# EAGLE design Grove - Gesture v1.0 (EAGLE 7.1.0)

## Sheet 1 of 2
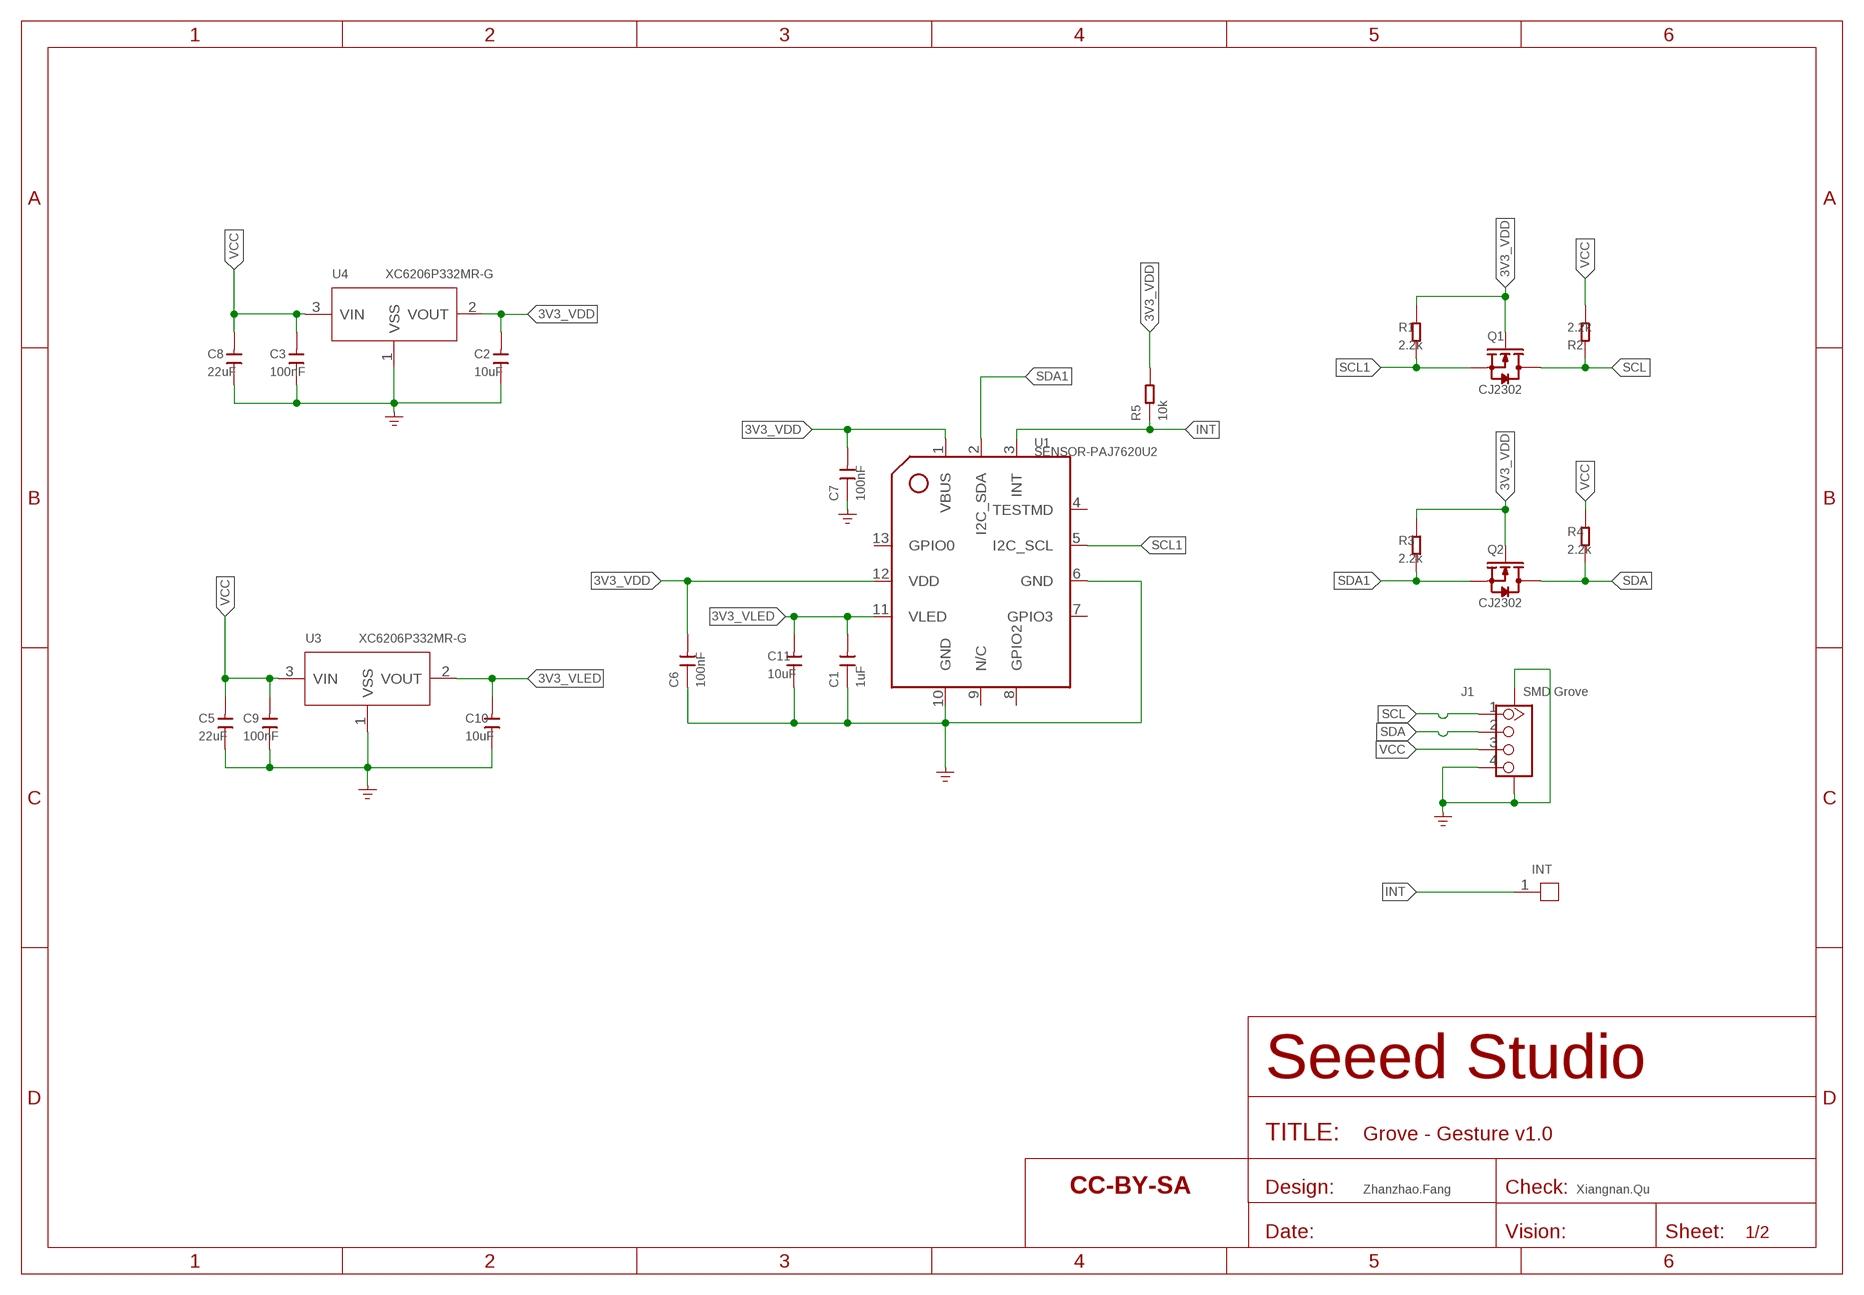
[diagram p0: schematic, sheet 1]

### Parts
C1  1uF  CAP-0603  [C0603]
C2  10uF  CAP-0603  [C0603]
C3  100nF  CAP-0603  [C0603]
C5  22uF  CAP-0805  [C0805]
C6  100nF  CAP-0603  [C0603]
C7  100nF  CAP-0603  [C0603]
C8  22uF  CAP-0805  [C0805]
C9  100nF  CAP-0603  [C0603]
C10  10uF  CAP-0603  [C0603]
C11  10uF  CAP-0603  [C0603]
INT  DNP  HEADER-1P-40  [1P-80/40MIL]
J1  SMD Grove  GROVE-CONNECTOR-SMD'90D'  [HW4-SMD-2.0-90D]
Q1  CJ2302  MOSFET-N'SOT23'  [SOT-23]
Q2  CJ2302  MOSFET-N'SOT23'  [SOT-23]
R1  2.2k  RES-0603  [R0603]
R2  2.2k  RES-0603  [R0603]
R3  2.2k  RES-0603  [R0603]
R4  2.2k  RES-0603  [R0603]
R5  10k  RES-0603  [R0603]
U1  SENSOR-PAJ7620U2  [LGA13-SMD-L5.2*W3*H2MM]
U3  XC6206P332MR-G  PMIC-XC6206PMR  [SOT-23]
U4  XC6206P332MR-G  PMIC-XC6206PMR  [SOT-23]
U$4  SEEEDSTUDIO-OPEN-SCH-FRAME  [SEEEDSTUDIO-PCB-FRAME]

### Nets
3V3_VDD: C2.2 C6.2 C7.2 Q1.1(G) Q2.1(G) R1.2 R3.2 R5.2 U1.1(VBUS) U1.12(VDD) U4.2(VOUT)
3V3_VLED: C1.2 C10.2 C11.2 U1.11(VLED) U3.2(VOUT)
GND: C1.1 C2.1 C3.1 C5.1 C6.1 C7.1 C8.1 C9.1 C10.1 C11.1 J1.4 J1.SS1 J1.SS2 U1.6(GND) U1.10(GND) U3.1(VSS) U4.1(VSS) ; supply symbol labelled GND_POWER
INT: INT.1 R5.1 U1.3(INT)
SCL: J1.1 Q1.3(D) R2.1
SCL1: Q1.2(S) R1.1 U1.5(I2C_SCL)
SDA: J1.2 Q2.3(D) R4.1
SDA1: Q2.2(S) R3.1 U1.2(I2C_SDA)
VCC: C3.2 C5.2 C8.2 C9.2 J1.3 R2.2 R4.2 U3.3(VIN) U4.3(VIN)
Unconnected: U1.4(TESTMD) U1.7(GPIO3) U1.8(GPIO2) U1.9(N/C) U1.13(GPIO0)

### Notes on the sheet
- Zhanzhao.Fang | Xiangnan.Qu

## Sheet 2 of 2
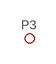
[diagram p1: schematic, sheet 2]

### Parts
P3  PAD-MARK'ANNULAR'  [ROUND-MARK-1.0]

## Library data of the parts
C1-C3 C5-C11 = Discrete-new:CAP: Ceramic Capacitors
INT = Connector-new:HEADER-1P
J1 = Connector-new:GROVE-CONNECTOR-SMD: 4P-SMD-2.0:320110030;4P-SMD-2.0-90D:320110032
P3 = Discrete-new:PAD-MARK; PARTNO: DNP
Q1 Q2 = Discrete-new:MOSFET-N: IRLL014: http://www.vishay.com/docs/91319/sihll014.pdf
R1-R5 = Discrete-new:RES
U1 = template:SENSOR-PAJ7620U2
U3 U4 = IC-new:PMIC-XC6206P: LOW ESR Cap.Compatible Positive Voltage Regulators
U$4 = moudle-new:SEEEDSTUDIO-OPEN-SCH-FRAME

## Net classes
0 default: width 0.102 mm, drill 0.203 mm, clearance 0.102 mm
3 usbvcc: width 0.203 mm, drill 0.305 mm, clearance 0.203 mm

## Board
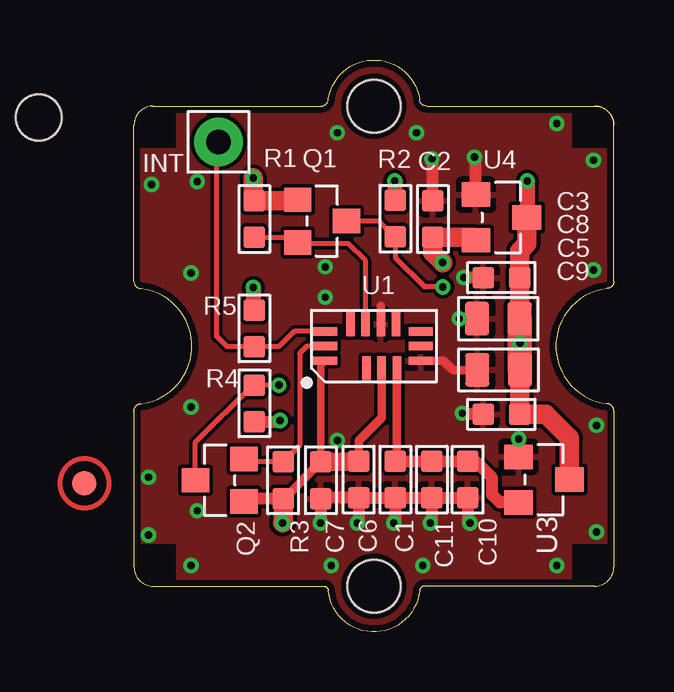
[diagram p2: board, top side]
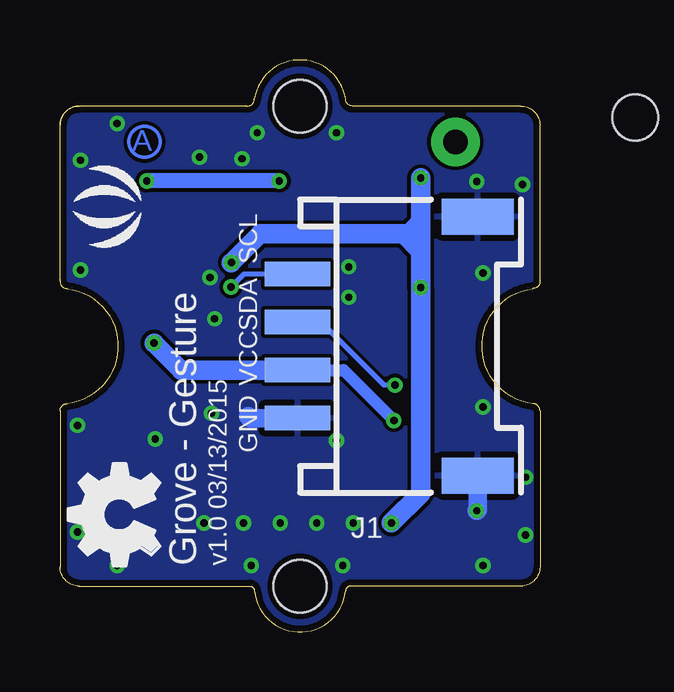
[diagram p3: board, bottom side, seen from below]

Size 20 x 23.83 mm. Coordinates in mm from the lower left corner, seen from the top.
Copper layers (1*16): Top 0.035mm / dielectric 1.5mm / Bottom 0.035mm
Design rules "SeeedStudio_2layer_DRU_no_angle_20140221 *": minimum track width 6mil, minimum drill 12mil, track to track 6mil, track to pad 6mil, pad to pad 6mil, via to via 6mil, smd to smd 0mil, copper to edge 10mil, drill to drill 10mil, minimum pad ring 10mil, minimum via ring 6mil, stop-mask expansion 2mil, vias tented up to drill 25mil, thermal gap 10mil
Holes 1.91 mm at -3.97,21.43

### Footprints (pad centres in the part's own frame; a part is rotated, then mirrored left to right if it is on the bottom)
C0603 = smd 0.889 x 0.889: 1 0,0.762; 2 0,-0.762
C0805 = smd 1.397 x 1.016: 1 0,0.889; 2 0,-0.889
1P-80/40MIL = drill 1.016 pad 2.032: 1 0,0
HW4-SMD-2.0-90D = smd 1.01 x 2.74: 1 -3,-0.1; 2 -1,-0.1; 3 1,-0.1; 4 3,-0.1 | smd 1.5 x 3: SS1 -5.4,7.4; SS2 5.4,7.4
ROUND-MARK-1.0 = smd 1.016 x 1.016: P$1 0,0
SOT-23 = smd 1.016 x 1.143: 1 -0.889,-1.016; 2 0.889,-1.016; 3 0,1.016
R0603 = smd 0.889 x 0.889: 1 0,0.762; 2 0,-0.762
LGA13-SMD-L5.2*W3*H2MM = smd 1 x 0.35: 1 2.02,0.61; 2 2.02,0; 3 2.02,-0.61; 8 -1.96,-0.61; 9 -1.96,0; 10 -1.96,0.61 | smd 0.35 x 1: 4 0.983,-0.92; 5 0.348,-0.92; 6 -0.287,-0.92; 7 -0.922,-0.92; 11 -0.953,0.92; 12 -0.318,0.92; 13 0.318,0.92
SOT-23' = smd 1.016 x 1.2: 1 -0.95,-1.06; 2 0.95,-1.06; 3 0,1.06
GROVE-1*1-TEST-PLATFORM = hole 2.2: 0,-10; 0,10

### Placement (x,y rotation side)
C1  10.89,6.35 180 top
C2  12.45,17.2 0 top
C3  15.31,14.77 90 top
C5  15.19,10.92 90 top
C6  9.37,6.35 180 top
C7  7.79,6.32 180 top
C8  15.18,13.05 90 top
C9  15.31,9.06 90 top
C10  13.9,6.35 180 top
C11  12.41,6.35 180 top
INT  3.52,20.42 0 top
J1  10,11.91 270 bottom
P3  -2.06,6.19 0 top
Q1  7.84,17.12 270 top
Q2  3.57,6.32 90 top
R1  5.02,17.2 180 top
R2  10.89,17.22 180 top
R3  6.22,6.32 0 top
R4  5.02,9.52 0 top
R5  5.02,12.64 180 top
U1  10,11.91 180 top
U3  XC6206P332MR-G  [SOT-23']  17.09,6.35 270 top
U4  XC6206P332MR-G  [SOT-23']  15.31,17.27 270 top
U$1  [OSHW_FILLX150_NOTEXT]  15.84,2.76 90 bottom
U$4  -10.32,-8.79 0 top  (outside the outline)
U$5  [GROVE-1*1-TEST-PLATFORM]  10,11.91 0 top
U$6  [GROVE-1*1-TEST-PLATFORM]  10,11.91 0 top
U$15  [SEEED-SILK-160*153MIL]  18.13,17.75 90 bottom

### Tracks (layer width: path | path; a pad name or v marks a point on that pad's centre or on a via)
3V3_VDD  (via drill 0.3 pad 0.64)
  Top 0.203: 6.9,17.78 6.9,17.93 Q1.1
  Top 0.305: C7.2 7.79,11.11 U1.1
  Top 0.356: 9.24,7.23 C6.2 9.37,7.97 10.32,8.92 U1.12 | R3.2 6.27,5.56 C7.2
  Top 0.508: R3.2 4.72,5.56 Q2.1
  Top 0.635: v4.97,14.35 4.97,13.46 R5.2
  Top 0.762: C7.2 9.34,7.08 C6.2
  Top 0.813: U4.2 14.12,16.44 C2.2 12.45,15.79 v12.86,15.39 | R3.2 6.21,4.57 v6.19,4.54 | v4.97,18.92 4.97,18.02 R1.2 6.79,17.97 Q1.1
  Bottom 0.508: v12.86,15.39 12.77,15.39
  Bottom 0.813: 5.68,16.58 11.66,16.58 v12.86,15.39 | 5.48,16.58 4.97,16.58 | 4.97,15.87 v4.97,14.35 4.97,5.76 v6.19,4.54 | 4.97,15.87 4.97,16.58 | 4.97,16.58 v4.97,18.92 | 5.68,16.58 5.48,16.58 | 5.48,16.58 5.07,16.99 | 5.68,16.58 4.97,15.87
3V3_VLED
  Top 0.203: 10.89,7.08 11.02,7.08 10.89,7.21 11.14,7.21 11.04,7.11 C1.2 10.95,7.17 10.95,7.15 10.89,7.08 | 10.89,7.08 10.76,7.21
  Top 0.356: U1.11 10.95,7.17
  Top 0.508: C1.2 C11.2 C10.2 14.24,7.11 14.93,6.42 14.93,5.71 15.24,5.4 U3.2
GND  (via drill 0.3 pad 0.64)
  Top 0.356: U1.6 10.29,13.59 | U1.10 12.9,11.3 13.3,10.89 14.28,10.89 C5.1
  Top 0.508: C6.1 C1.1 | C1.1 C11.1 | C2.1 12.45,19.68 v12.41,19.72 | U4.1 14.25,19.72 v14.19,19.78 | C8.1 v13.56,13.05 | C3.1 v13.75,14.77 | C9.1 13.73,9.06 v13.68,9.11 | U3.1 v16.03,8.03 v16.03,8.04 | C6.1 7.82,5.58 C7.1 7.79,4.56 v7.78,4.54 | C11.1 C10.1 13.9,4.64 v14,4.54 | C11.1 12.41,4.61 v12.35,4.54 | C1.1 10.89,4.61 v10.83,4.54 | C6.1 9.37,4.61 v9.3,4.54
  Bottom 0.762: J1.4 12.08,8.91 12.16,8.99 | J1.SS2 2.6,5.08 v2.63,5.05
  other vias: 2.63,18.77 19.14,19.66 11.78,20.8 8.48,20.8 19.14,15.08 19.27,8.61 19.27,4.16 0.6,4.03 8.22,2.76 12.03,2.76 2.38,9.37 2.38,14.96 7.97,15.21 7.97,13.94 8.48,7.97 0.6,6.45 2.38,2.76 17.62,2.76 17.62,21.18 0.73,18.64
  pour Top (rank 6): -3.34,24.61 21.3,24.61 21.3,-1.55 -3.34,-1.55
  pour Bottom (rank 6): -3.34,25.12 21.3,25.12 21.3,-1.05 -3.34,-1.05
INT
  Top 0.203: INT.1 3.45,20.34 3.45,12.31 3.88,11.88 R5.1 5.05,11.91 | 4.97,11.91 5.05,11.91 | 5.05,11.91 6.06,11.91 6.67,12.52 U1.3
SCL  (via drill 0.3 pad 0.64)
  Top 0.203: Q1.3 10.23,17.12 R2.1 10.89,15.59 12.11,14.37 v12.87,14.37
  Bottom 0.203: 10.15,14.85 J1.1 12.33,14.91 v12.87,14.37
SCL1
  Top 0.203: R1.1 6.61,16.44 Q1.2 | U1.5 9.65,15.46 8.93,16.18 6.88,16.18 Q1.2 | 7.1,16.25 6.85,16.25 Q1.2
SDA  (via drill 0.3 pad 0.64)
  Top 0.203: v6.04,10.28 R4.1 4.95,10.28 2.56,7.9 Q2.3
  Bottom 0.203: J1.2 9.12,12.91 6.5,10.28 v6.04,10.28
SDA1
  Top 0.203: U1.2 7.21,11.91 6.9,11.6 6.9,7.77 R3.1 4.72,7.08 Q2.2
VCC  (via drill 0.3 pad 0.64)
  Top 0.508: R4.2 6.04,8.76 v6.09,8.81 | C9.2 16.07,9.19 16.08,9.2 | 16.08,14.63 16.08,14.75 C3.2
  Top 0.635: R2.2 10.89,18.77 v10.86,18.79 | v16.39,18.79 16.39,17.29 U4.3
  Top 0.813: 16.08,13.04 16.08,14.63 | U4.3 16.37,16.17 16.07,15.87 C3.2 | C5.2 16.08,9.2 | U3.3 18.15,8.08 17.16,9.06 C9.2
  Top 1.016: C5.2 v16.08,12.04 16.08,13.04 C8.2
  Bottom 0.508: v6.09,8.81 8.19,10.91 J1.3
  Bottom 0.635: v10.86,18.79 v16.39,18.79
  Bottom 0.813: J1.3 14.96,10.91 v16.08,12.04
(copper drawn outside any net)
  shapes: Bottom circle x1

### Text on the board
Bottom: A
bPlace: v1.0 03/13/2015 | Grove - Gesture
bNames: SCL | SDA | VCC | GND